# EasyEDA schematic 4.46.json
TITLE: Sheet_1; REV: 1.0; Date: 2020-11-18; Sheet: 1/1; Drawn By: Gökbey Keskin; Company: Your Company
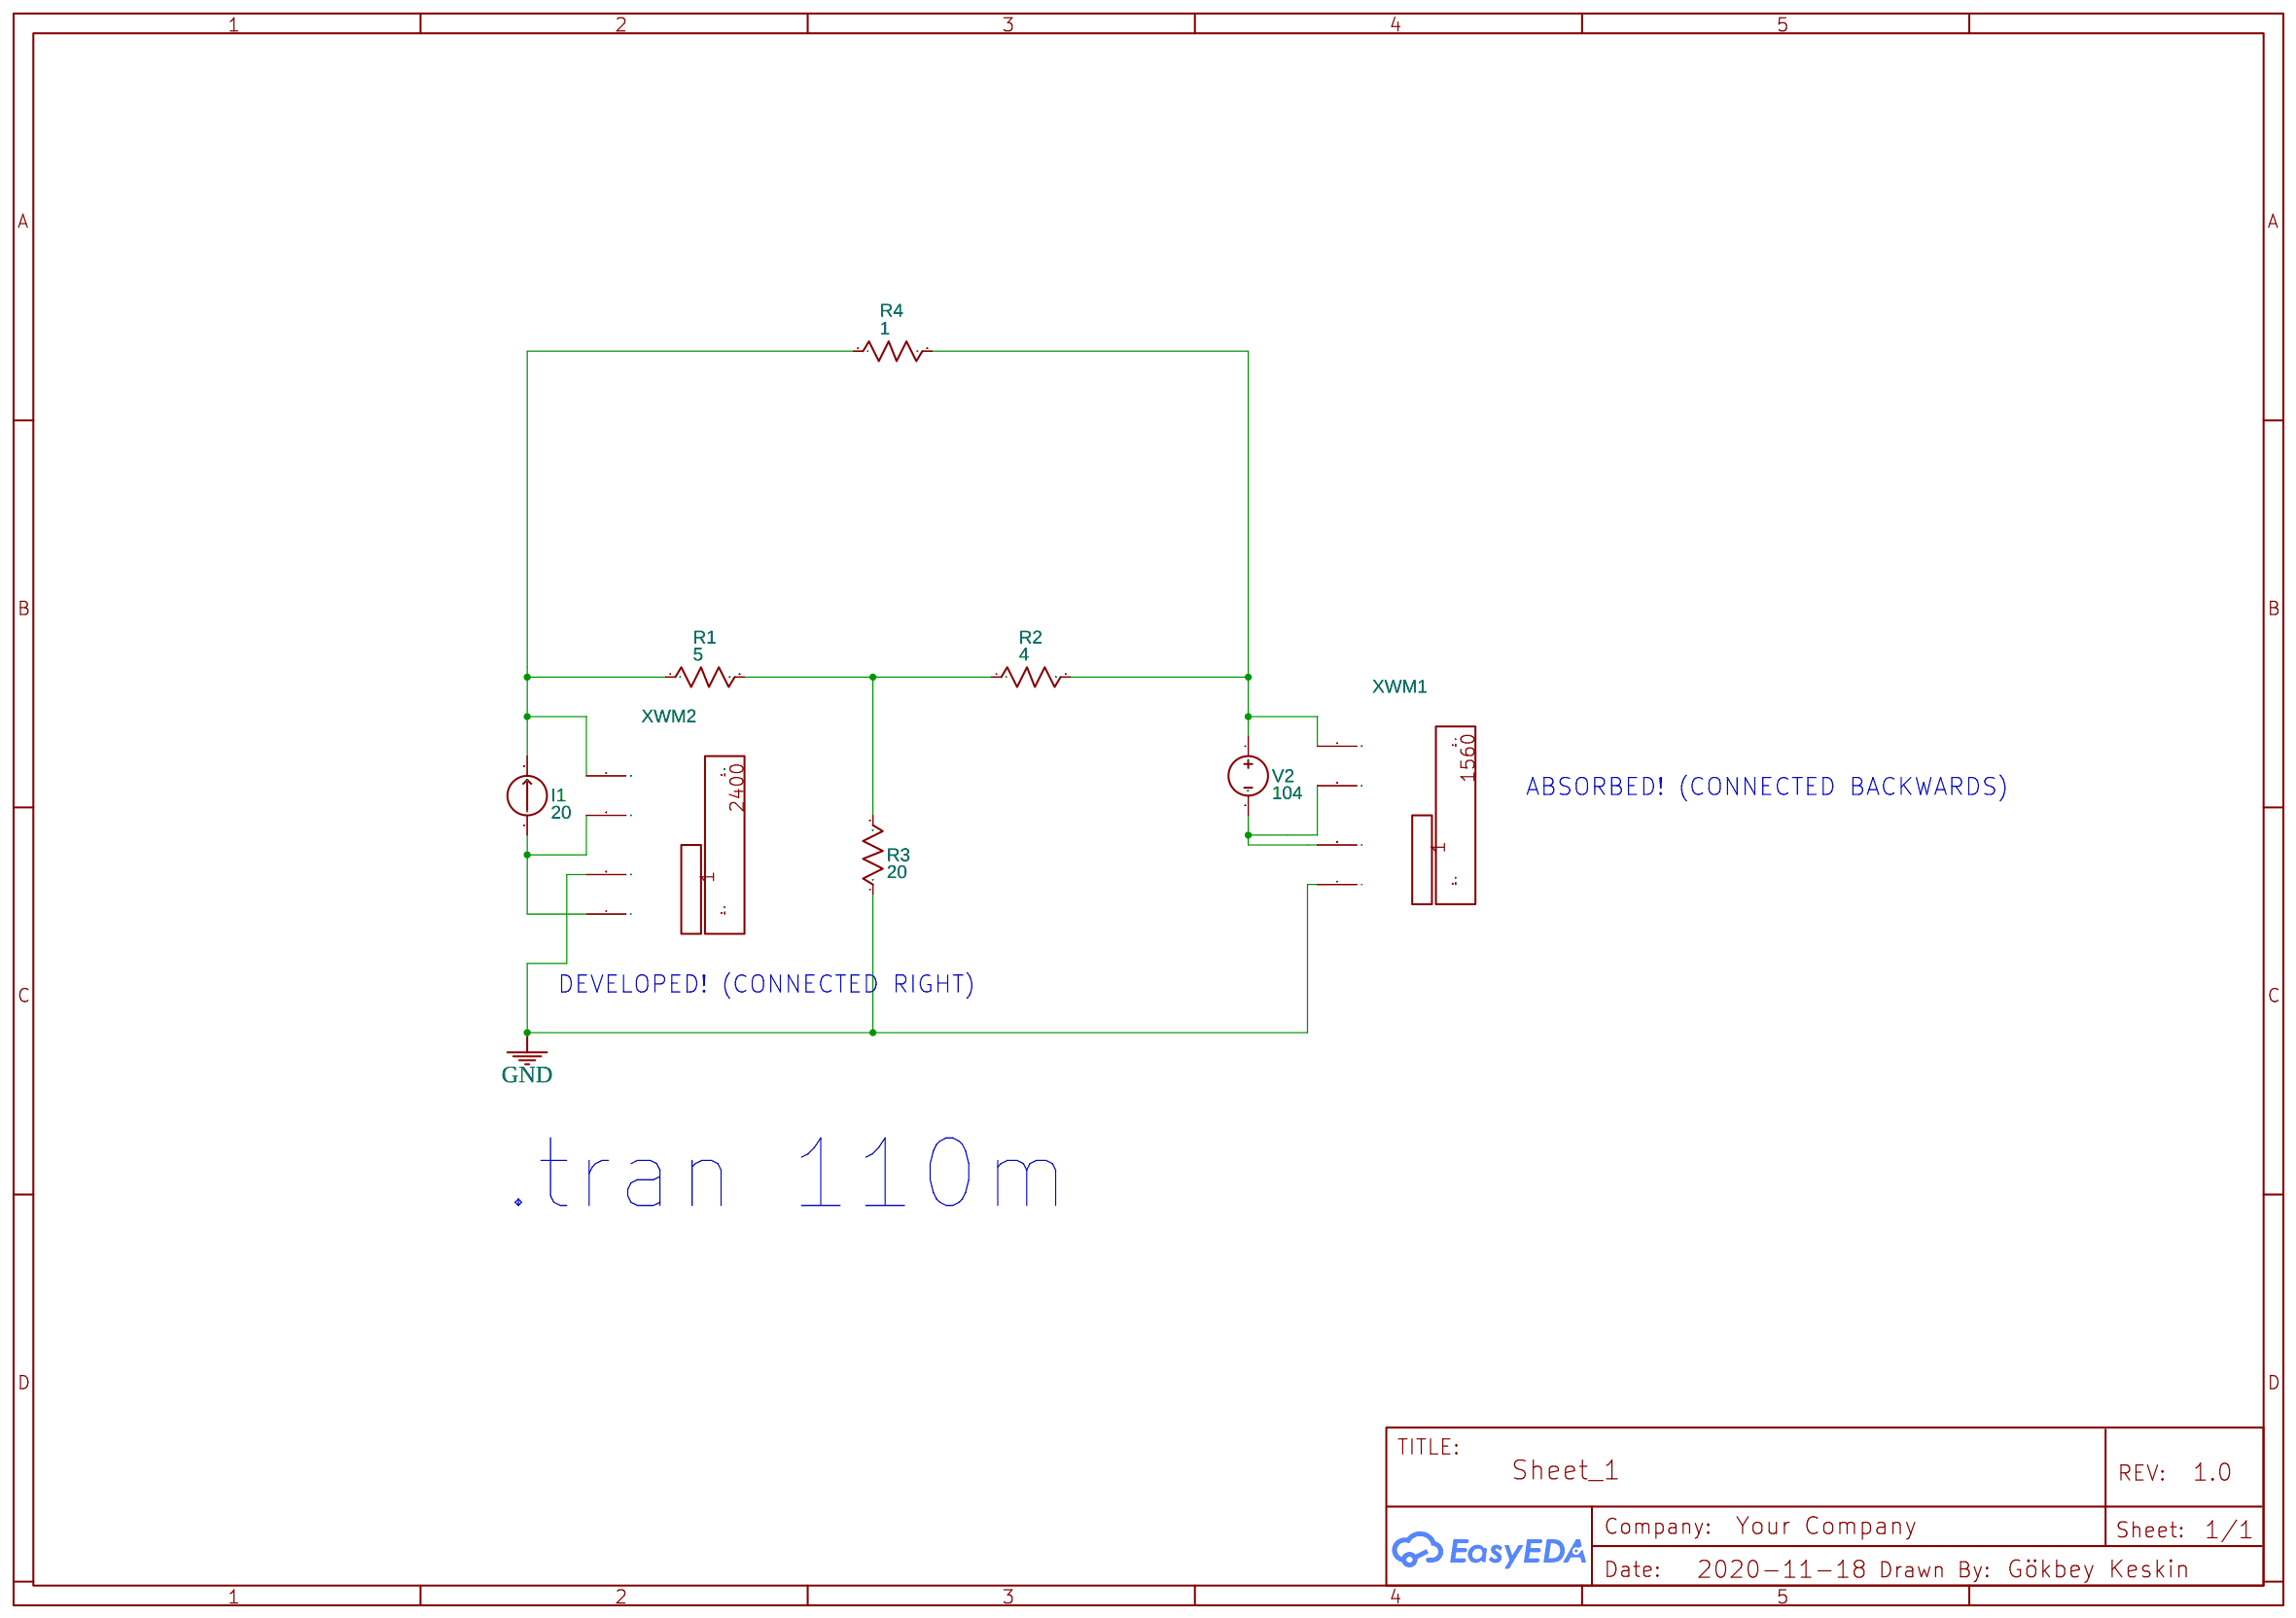
[diagram p0: schematic sheet]

## Parts
I1  20  [2P-5.08]
R1  5  [AXIAL-0.3]
R2  4  [AXIAL-0.3]
R3  20  [AXIAL-0.3]
R4  1  [AXIAL-0.3]
V2  104  [HDR1X2]
XWM1  Wattmeter
XWM2  Wattmeter

## Library data of the parts
I1 = IDC: Contributor: EasyEDA; sim: true
R1-R4 = Resistor_US: Resistance: 1k; Contributor: EasyEDA; Supplier: YUJING
V2 = VDC: Contributor: EasyEDA; sim: true
XWM1 XWM2 = WATTMETER: Contributor: EasyEDA; NameDisplay: 0; sim: true

## Nets
GND: R3.1 XWM1.4(I-) XWM2.3(I+)
Net-(I1-1): I1.1 XWM2.2(V-) XWM2.4(I-)
Net-(I1-2): I1.2 R1.1 R4.1 XWM2.1(V+)
Net-(R1-2): R1.2 R2.1 R3.2
Net-(R2-2): R2.2 R4.2 V2.1 XWM1.1(V+)
Net-(V2-2): V2.2 XWM1.2(V-) XWM1.3(I+)

Not connected (* = marked no-connect by the designer): XWM1 P PF; XWM2 P PF

## Notes on the sheet
- ABSORBED! (CONNECTED BACKWARDS)
- DEVELOPED! (CONNECTED RIGHT)
- .tran 110m
